# Altium schematic sheet trolley.SchDoc
size A
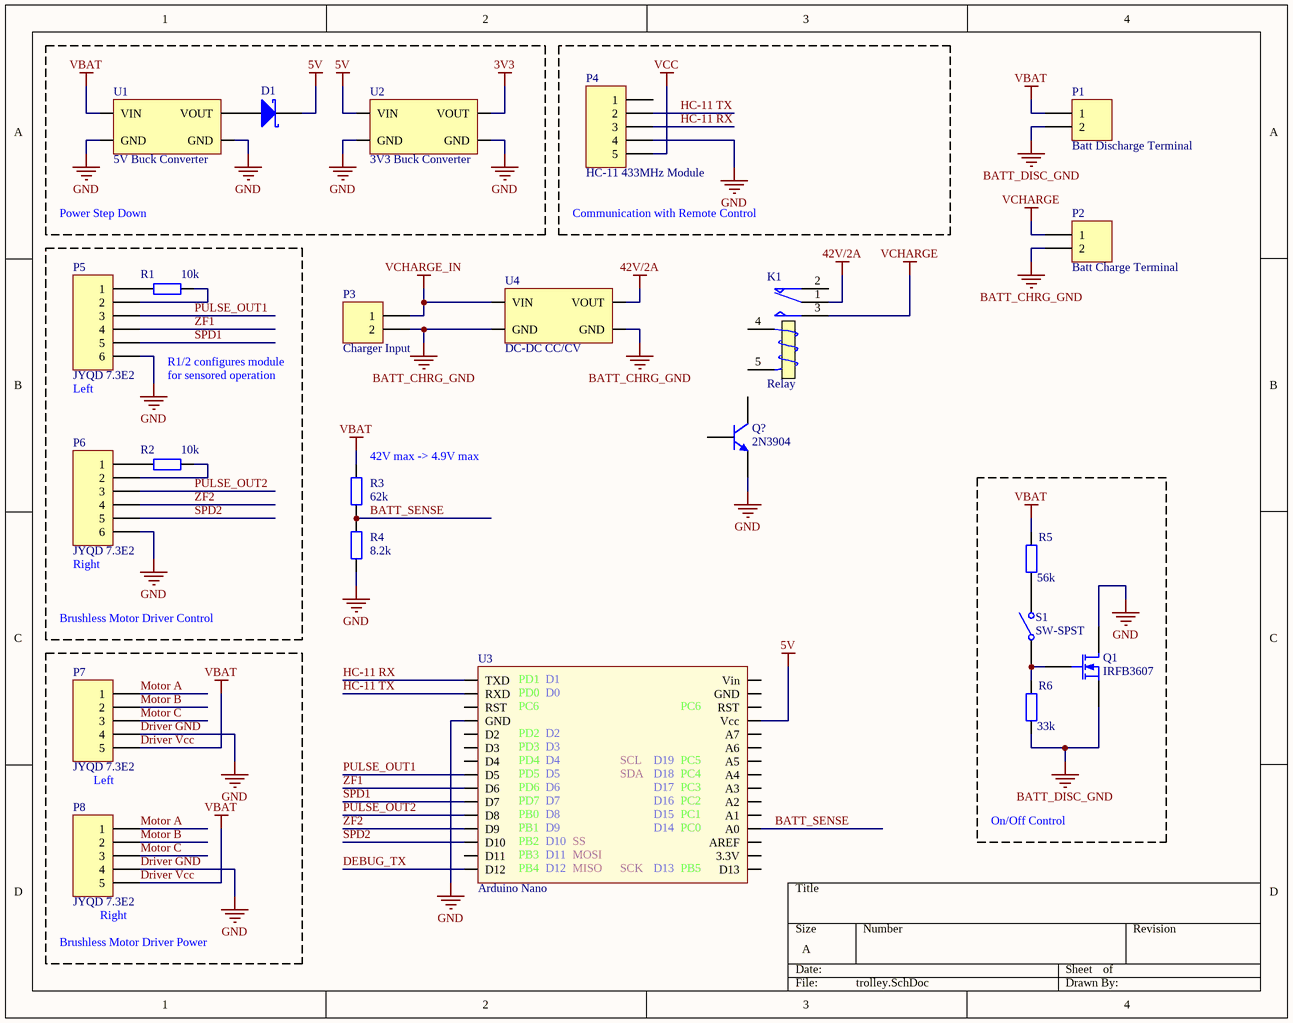
[diagram p0: trolley.SchDoc]

## Parts
D1  D Schottky  [SMB]  (value not drawn)
K1  Relay  [MODULE5B]
P1  Batt Discharge Terminal  [HDR1X2]
P2  Batt Charge Terminal  [HDR1X2]
P3  Charger Input  [HDR1X2]
P4  HC-11 433MHz Module  [HDR1X5]
P5  JYQD 7.3E2  [HDR1X6]
P6  JYQD 7.3E2  [HDR1X6]
P7  JYQD 7.3E2  [HDR1X5]
P8  JYQD 7.3E2  [HDR1X5]
Q1  IRFB3607  [E3]
Q?  2N3904  [TO-92A]
R1  10k  [AXIAL-0.4]
R2  10k  [AXIAL-0.4]
R3  value 62k  [AXIAL-0.4]  (hidden comment: Res2)
R4  value 8.2k  [AXIAL-0.4]  (hidden comment: Res2)
R5  value 56k  [AXIAL-0.4]  (hidden comment: Res2)
R6  value 33k  [AXIAL-0.4]  (hidden comment: Res2)
S1  SW-SPST  [SPST-2]
U1  5V Buck Converter
U2  3V3 Buck Converter
U3  Arduino Nano  [Arduino Nano Footprint]
U4  DC-DC CC/CV

## Blocks framed on the sheet
Power Step Down: D1 U1 U2
Communication with Remote Control: P4
On/Off Control: Q1 R5 R6 S1

## Nets
3V3: U2.VIN(VOUT)
5V: D1.2(K) U2.VIN U3.Vcc
42V/2A: K1.1(COM) U4.VIN(VOUT)
BATT_CHRG_GND: P2.2 P3.2 U4.VIN(GND)
BATT_DISC_GND: P1.2 Q1.3(S) R6.1
Driver GND: P4.4 P5.6 P6.6 P7.4 P8.4 Q1.1(D) Q?.1(E) R4.1 U1.VIN(GND) U2.VIN(GND) U3.GND1(GND)  [also labelled GND]
Driver Vcc: P1.1 P7.5 P8.5 R3.2 R5.2 U1.VIN  [also labelled VBAT]
VCC: P4.5
VCHARGE: K1.3(NO) P2.1
VCHARGE_IN: P3.1 U4.VIN
BATT_SENSE: R3.1 R4.2 U3.A0
DEBUG_TX: U3.D12
HC-11 RX: P4.3 U3.TXD
HC-11 TX: P4.2 U3.RXD
Motor A: P7.1 P8.1
Motor B: P7.2 P8.2
Motor C: P7.3 P8.3
PULSE_OUT1: P5.3 U3.D5
PULSE_OUT2: P6.3 U3.D8
SPD1: P5.5 U3.D7
SPD2: P6.5 U3.D10
ZF1: P5.4 U3.D6
ZF2: P6.4 U3.D9
NetD1_1: D1.1(A) U1.VIN(VOUT)
NetP5_1: P5.1 R1.1
NetP5_2: P5.2 R1.2
NetP6_1: P6.1 R2.1
NetP6_2: P6.2 R2.2
NetQ1_2: Q1.2(G) R6.2 S1.1(COMMON)
NetR5_1: R5.1 S1.2(NO)

Not connected (* = marked no-connect by the designer): K1 2(NC) 4(T1) 5(T2); P4 1; Q? 2(B) 3(C); U3 3.3V A1 A2 A3 A4 A5 A6 A7 AREF D2 D3 D4 D11 D13 GND2(GND) RST1(RST) RST2(RST) Vin

## Notes on the sheet
- R1/2 configures module
- (near P5) Left
- for sensored operation
- (near R3) 42V max -> 4.9V max
- (near P6) Right
- Brushless Motor Driver Control
- Left
- Brushless Motor Driver Power
- (near P8) Right
- (in symbol Arduino Nano) PD1; D1; PD0; D0; PC6; PD2; PD3; PD4; SCL; D19; PC5; PD5; SDA; D18; PC4; PD6; D17; PC3; PD7; D16; PC2; PB0; D15; PC1; PB1; D14; PC0; PB2; SS; PB3; MOSI; PB4; MISO; SCK; PB5

## Library data of the parts
D1 = D Schottky: Schottky Diode; Published: 8-Jun-2000; LatestRevisionDate: 17-Jul-2002; LatestRevisionNote: Re-released for DXP Platform.; PackageReference: SMB; Publisher: Altium Limited; PackageDescription: DO-214-AA/SMB; 2 C-Bend Leads; Body 5.3 x 3.6 mm, inc. leads (LxW); Code_JEDEC: DO-214-AA
K1 = Relay: SPDT Relay; Published: 8-Jun-2000; LatestRevisionDate: 17-Jul-2002; LatestRevisionNote: Re-released for DXP Platform.; PackageReference: MODULE5B; Publisher: Altium Limited
P1-P3 = Header 2: Header, 2-Pin; LatestRevisionDate: 17-Jul-2002; LatestRevisionNote: Re-released for DXP Platform.; Publisher: Altium Limited
P4 P7 P8 = Header 5: Header, 5-Pin; LatestRevisionDate: 17-Jul-2002; LatestRevisionNote: Re-released for DXP Platform.; Publisher: Altium Limited
P5 P6 = Header 6: Header, 6-Pin; LatestRevisionDate: 17-Jul-2002; LatestRevisionNote: Re-released for DXP Platform.; Publisher: Altium Limited
Q1 = MOSFET-N: N-Channel MOSFET; Published: 8-Jun-2000; LatestRevisionDate: 17-Jul-2002; LatestRevisionNote: Re-released for DXP Platform.; PackageVersion: 1995/1996; PackageReference: E3; Publisher: Altium Limited; PackageDescription: TO, Flat Index; 3 In-Line, Axial Leads; Body Dia. 4.6mm; Lead Dia. 0.5 mm (max)
Q? = 2N3904: NPN General Purpose Amplifier; Published: 8-Jun-2000; LatestRevisionDate: 15-Jan-2003; LatestRevisionNote: PCB Footprint 'BCY-W3/D4.7' replaced; DatasheetVersion: 1997; PackageVersion: Sep-1998; PackageReference: TO-92A; Publisher: Altium Limited; PackageDescription: TO, Flat Index; 3 In-Line, Axial Leads; Body Dia. 4.5mm; Leads 0.51 x 0.48 mm (max); ComponentLink1Description: Manufacturer Link; ComponentLink1URL: http://www.fairchildsemi.com/; ComponentLink2Description: Datasheet; ComponentLink2URL: http://www.fairchildsemi.com/ds/2N%2F2N3904.pdf
R1-R6 = Res2: Resistor; Published: 8-Jun-2000; LatestRevisionDate: 17-Jul-2002; LatestRevisionNote: Re-released for DXP Platform.; PackageReference: AXIAL-0.4; Publisher: Altium Limited; PackageDescription: Axial Device, Thru-Hole; 2 Leads; 0.4 in Pin Spacing
  R1 R2: Value: 10k
S1 = SW-SPST: Single-Pole, Single-Throw Switch; Published: 24-Mar-1999; LatestRevisionDate: 17-Jul-2002; LatestRevisionNote: Re-released for DXP Platform.; PackageReference: SPST-2; Publisher: Altium Limited; PackageDescription: Switch; 2 Leads
U1 U2 U4 = DC-DC